# Altium project PCB_Project1.PrjPCB
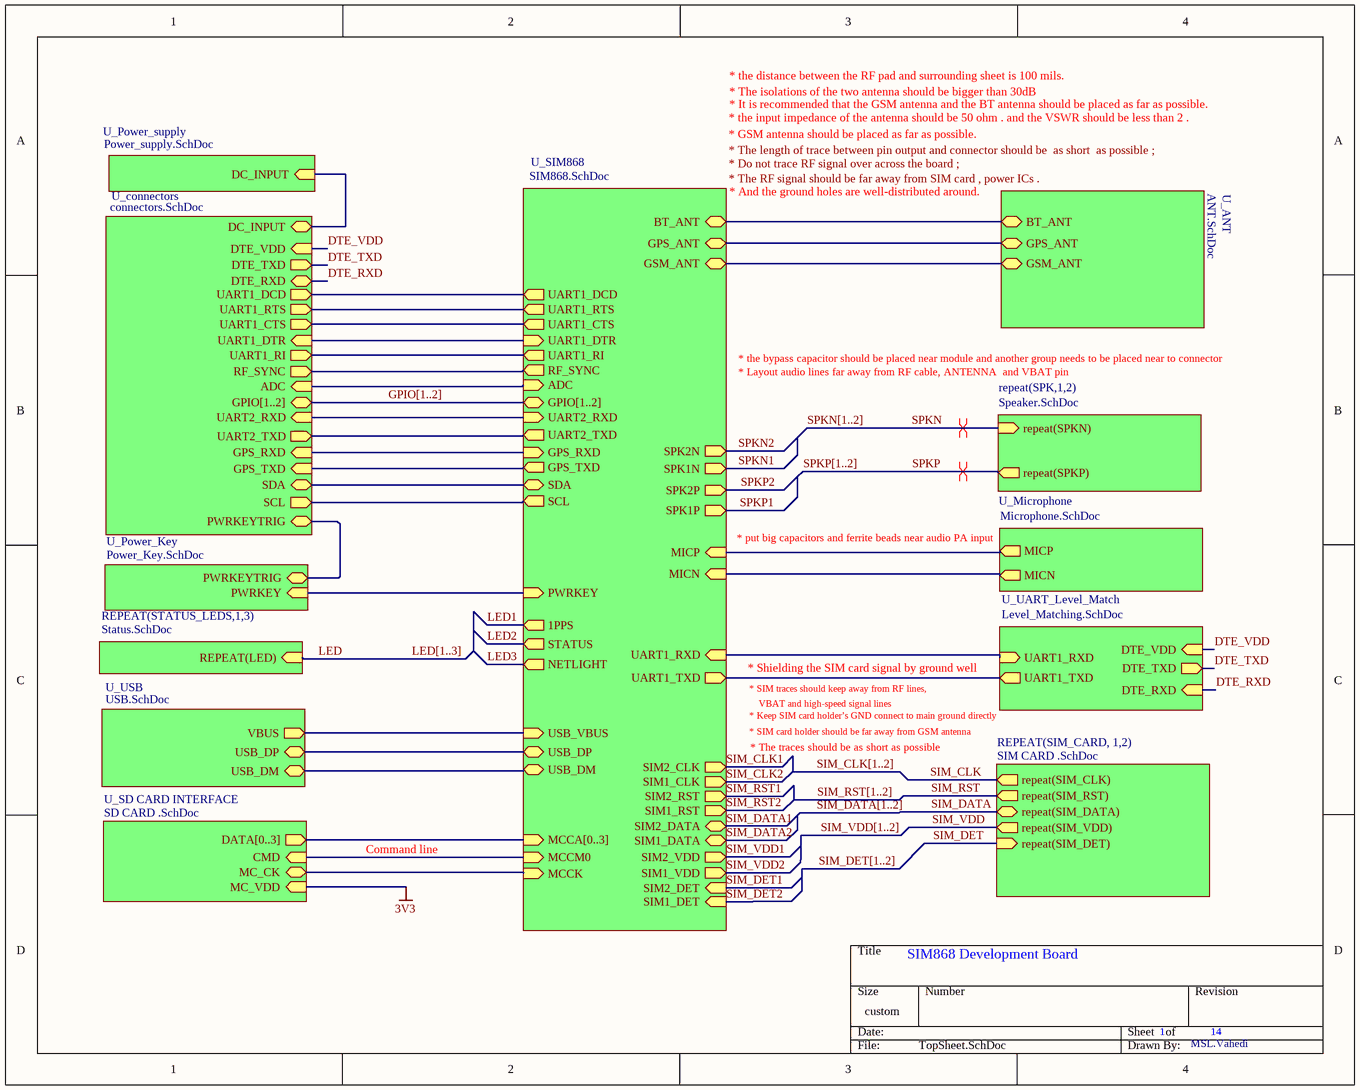
[diagram p0: TopSheet.SchDoc]
14 sheets, 152 parts. Net scope: hierarchical (ports join the sheet entries above them; power ports are global).
Board file: Sim_868_dev_board.PcbDoc
Sheets:
  TopSheet.SchDoc
    U_SIM868 = SIM868.SchDoc
    U_SD CARD INTERFACE = SD CARD .SchDoc
    U_USB = USB.SchDoc
    U_ANT = ANT.SchDoc
      AMC1 = Antenna matching circuit.SchDoc
      AMC2 = Antenna matching circuit.SchDoc
      AMC3 = Antenna matching circuit.SchDoc
    STATUS_LEDS1 = Status.SchDoc
    STATUS_LEDS2 = Status.SchDoc
    STATUS_LEDS3 = Status.SchDoc
    U_Power_Key = Power_Key.SchDoc
    U_UART_Level_Match = Level_Matching.SchDoc
    U_Microphone = Microphone.SchDoc
    SPK1 = Speaker.SchDoc
    SPK2 = Speaker.SchDoc
    U_connectors = connectors.SchDoc
    SIM_CARD1 = SIM CARD .SchDoc
    SIM_CARD2 = SIM CARD .SchDoc
    U_Power_supply = Power_supply.SchDoc

## Sheet TopSheet.SchDoc: SIM868 Development Board
size 254 x 203 mm; SheetNumber: 1; SheetTotal: 14

### Sub-sheets
REPEAT(SIM_CARD, 1,2) = SIM CARD .SchDoc: repeat(SIM_CLK) (out), repeat(SIM_RST) (out), repeat(SIM_DATA) (bidir), repeat(SIM_VDD) (out), repeat(SIM_DET) (in)
repeat(SPK,1,2) = Speaker.SchDoc: repeat(SPKP) (out), repeat(SPKN) (in)
REPEAT(STATUS_LEDS,1,3) = Status.SchDoc: REPEAT(LED) (in)
U_ANT = ANT.SchDoc: GSM_ANT (bidir), GPS_ANT (bidir), BT_ANT (bidir)
U_connectors = connectors.SchDoc: GPS_TXD (in), GPS_RXD (in), UART2_TXD (out), UART2_RXD (in), UART1_RTS (out), UART1_CTS (out), UART1_DCD (out), UART1_DTR (in), UART1_RI (out), GPIO[1..2] (bidir), PWRKEYTRIG (bidir), ADC (in), RF_SYNC (out), SDA (bidir), SCL (out), DTE_VDD (in), DTE_RXD (bidir), DTE_TXD (out), DC_INPUT (bidir)
U_Microphone = Microphone.SchDoc: MICP (out), MICN (out)
U_Power_Key = Power_Key.SchDoc: PWRKEY (in), PWRKEYTRIG (bidir)
U_Power_supply = Power_supply.SchDoc: DC_INPUT (in)
U_SD CARD INTERFACE = SD CARD .SchDoc: CMD (in), MC_CK (bidir), DATA[0..3] (out), MC_VDD (in)
U_SIM868 = SIM868.SchDoc: PWRKEY (in), SPK2N (out), SPK2P (out), SPK1N (out), SPK1P (out), MICN (in), MICP (in), MCCK (in), MCCM0 (in), 1PPS (out), MCCA[0..3] (in), NETLIGHT (out), STATUS (out), GPIO[1..2] (bidir), SIM2_DATA (bidir), SIM2_CLK (out), SIM2_RST (out), SIM2_VDD (out), GPS_TXD (out), GPS_RXD (in), UART1_TXD (out), UART1_RXD (in), UART2_TXD (out), UART2_RXD (in), USB_VBUS (in), USB_DP (bidir), USB_DM (bidir), ADC (in), SDA (bidir), SCL (out), SIM1_VDD (out), SIM1_DATA (bidir), SIM1_CLK (out), SIM1_RST (out), BT_ANT (bidir), GPS_ANT (bidir), GSM_ANT (bidir), RF_SYNC (out), UART1_RI (out), UART1_DTR (in), UART1_DCD (out), UART1_CTS (out), UART1_RTS (out), SIM1_DET (in), SIM2_DET (in)
U_UART_Level_Match = Level_Matching.SchDoc: DTE_VDD (in), DTE_RXD (in), UART1_TXD (out), DTE_TXD (out), UART1_RXD (in)
U_USB = USB.SchDoc: VBUS (out), USB_DM (bidir), USB_DP (bidir)

### Nets
ANTP1: sheet U_SIM868/GSM_ANT, sheet U_ANT/GSM_ANT
ANTP2: sheet U_SIM868/GPS_ANT, sheet U_ANT/GPS_ANT
DTE_RXD: sheet U_UART_Level_Match/DTE_RXD, sheet U_connectors/DTE_RXD
DTE_TXD: sheet U_UART_Level_Match/DTE_TXD, sheet U_connectors/DTE_TXD
DTE_VDD: sheet U_UART_Level_Match/DTE_VDD, sheet U_connectors/DTE_VDD
INPUT: sheet U_connectors/DC_INPUT, sheet U_Power_supply/DC_INPUT
LED: sheet REPEAT(STATUS_LEDS,1,3)/REPEAT(LED)
MIC_N: sheet U_SIM868/MICN, sheet U_Microphone/MICN
MIC_P: sheet U_SIM868/MICP, sheet U_Microphone/MICP
SIM_CLK: sheet REPEAT(SIM_CARD, 1,2)/repeat(SIM_CLK)
SIM_DATA: sheet REPEAT(SIM_CARD, 1,2)/repeat(SIM_DATA)
SIM_DET: sheet REPEAT(SIM_CARD, 1,2)/repeat(SIM_DET)
SIM_RST: sheet REPEAT(SIM_CARD, 1,2)/repeat(SIM_RST)
SIM_VDD: sheet REPEAT(SIM_CARD, 1,2)/repeat(SIM_VDD)
SPKN: sheet repeat(SPK,1,2)/repeat(SPKN)
SPKP: sheet repeat(SPK,1,2)/repeat(SPKP)
Net._2: sheet U_SIM868/PWRKEY, sheet U_Power_Key/PWRKEY
NetC9_2: sheet U_SIM868/USB_VBUS, sheet U_USB/VBUS
NetC108_2: sheet U_SIM868/BT_ANT, sheet U_ANT/BT_ANT
NetJ7_1: sheet U_Power_Key/PWRKEYTRIG, sheet U_connectors/PWRKEYTRIG
NetM1_1: sheet U_SIM868/UART1_TXD, sheet U_UART_Level_Match/UART1_TXD
NetM1_2: sheet U_SIM868/UART1_RXD, sheet U_UART_Level_Match/UART1_RXD
NetM1_3: sheet U_SIM868/UART1_RTS, sheet U_connectors/UART1_RTS
NetM1_4: sheet U_SIM868/UART1_CTS, sheet U_connectors/UART1_CTS
NetM1_5: sheet U_SIM868/UART1_DCD, sheet U_connectors/UART1_DCD
NetM1_6: sheet U_SIM868/UART1_DTR, sheet U_connectors/UART1_DTR
NetM1_7: sheet U_SIM868/UART1_RI, sheet U_connectors/UART1_RI
NetM1_22: sheet U_SIM868/UART2_TXD, sheet U_connectors/UART2_TXD
NetM1_23: sheet U_SIM868/UART2_RXD, sheet U_connectors/UART2_RXD
NetM1_25: sheet U_SIM868/USB_DP, sheet U_USB/USB_DP
NetM1_26: sheet U_SIM868/USB_DM, sheet U_USB/USB_DM
NetM1_29: sheet U_SIM868/RF_SYNC, sheet U_connectors/RF_SYNC
NetM1_38: sheet U_SIM868/ADC, sheet U_connectors/ADC
NetM1_50: sheet U_SIM868/MCCK, sheet U_SD CARD INTERFACE/MC_CK
NetM1_51: sheet U_SIM868/MCCM0, sheet U_SD CARD INTERFACE/CMD
NetM1_61: sheet U_SIM868/GPS_TXD, sheet U_connectors/GPS_TXD
NetM1_62: sheet U_SIM868/GPS_RXD, sheet U_connectors/GPS_RXD
NetM1_64: sheet U_SIM868/SDA, sheet U_connectors/SDA
NetM1_65: sheet U_SIM868/SCL, sheet U_connectors/SCL

### Buses and harness runs
bus GPIO[1..2] = sheet U_connectors/GPIO[1..2] = sheet U_SIM868/GPIO[1..2]
bus LED[1..3]
bus sheet U_SD CARD INTERFACE/DATA[0..3] = sheet U_SIM868/MCCA[0..3]
bus SIM_CLK[1..2]
bus SIM_DATA[1..2]
bus SIM_DET[1..2]
bus SIM_RST[1..2]
bus SIM_VDD[1..2]
bus SPKN[1..2]
bus SPKP[1..2]

### Layout directives
differential pair: SPKN, SPKP

### Notes on the sheet
- * The isolations of the two antenna should be bigger than 30dB
- * the distance between the RF pad and surrounding sheet is 100 mils.
- * the input impedance of the antenna should be 50 ohm . and the VSWR should be less than 2 .
- * GSM antenna should be placed as far as possible.
- * The length of trace between pin output and connector should be  as short  as possible ;
- * Do not trace RF signal over across the board ;
- * It is recommended that the GSM antenna and the BT antenna should be placed as far as possible.
- * The RF signal should be far away from SIM card , power ICs .
- * And the ground holes are well-distributed around.
- * the bypass capacitor should be placed near module and another group needs to be placed near to connector
- * Layout audio lines far away from RF cable, ANTENNA  and VBAT pin
- * put big capacitors and ferrite beads near audio PA input
- * Shielding the SIM card signal by ground well
- * SIM traces should keep away from RF lines,
- VBAT and high-speed signal lines
- * SIM card holder should be far away from GSM antenna
- * Keep SIM card holder’s GND connect to main ground directly
- * The traces should be as short as possible
- Command line
- MSL.Vahedi
- Title
- Size:
- Date:
- A
- Number:
- Time:
- Revision:
- Sheet
- of
- File:

## Sheet SIM868.SchDoc: Sim868 Development Board
size A; SheetNumber: 2; SheetTotal: 14
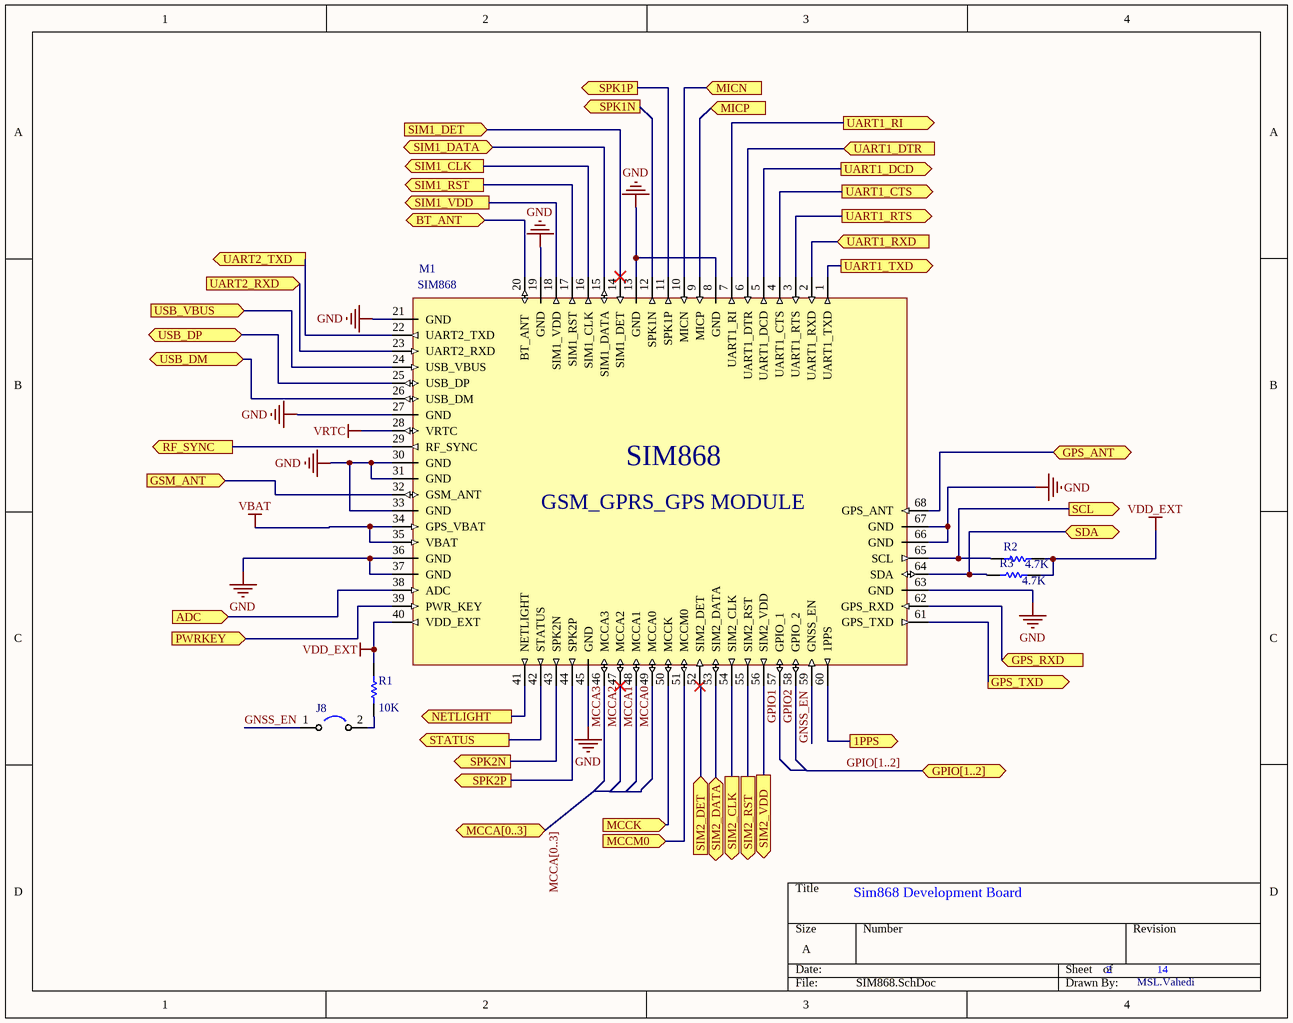
[diagram p1: SIM868.SchDoc]

### Parts
J8  (no value)  [JuMPER]
M1  SIM868  [SIM868]
R1  value 10K  [RES0805]
R2  value 4.7K  [RES0805]
R3  value 4.7K  [RES0805]

### Ports
1PPS (out), ADC (in), BT_ANT (bidir), GPIO[1..2] (bidir), GPS_ANT (bidir), GPS_RXD (in), GPS_TXD (out), GSM_ANT (in), MCCA[0..3] (bidir), MCCK (in), MCCM0 (in), MICN (in), MICP (in), NETLIGHT (out), PWRKEY (in), RF_SYNC (out), SCL (out), SDA (bidir), SIM1_CLK (out), SIM1_DATA (bidir), SIM1_DET (in), SIM1_RST (out), SIM1_VDD (out), SIM2_CLK (out), SIM2_DATA (bidir), SIM2_DET (in), SIM2_RST (out), SIM2_VDD (out), SPK1N (out), SPK1P (out), SPK2N (out), SPK2P (out), STATUS (out), UART1_CTS (out), UART1_DCD (out), UART1_DTR (in), UART1_RI (out), UART1_RTS (out), UART1_RXD (in), UART1_TXD (out), UART2_RXD (in), UART2_TXD (out), USB_DM (bidir), USB_DP (bidir), USB_VBUS (in)

### Nets
GND: M1.8(GND) M1.13(GND) M1.19(GND) M1.21(GND) M1.27(GND) M1.30(GND) M1.31(GND) M1.33(GND) M1.36(GND) M1.37(GND) M1.45(GND) M1.63(GND) M1.66(GND) M1.67(GND)
VBAT: M1.34(GPS_VBAT) M1.35(VBAT)
VDD_EXT: M1.40(VDD_EXT) R1.2 R2.2 R3.2
VRTC: M1.28(VRTC)
ANTP1: M1.32(GSM_ANT) ; port GSM_ANT
ANTP2: M1.68(GPS_ANT) ; port GPS_ANT
DIFF_SPK_N: M1.12(SPK1N) ; port SPK1N
DIFF_SPK_N: M1.43(SPK2N) ; port SPK2N  [a separate net that carries the same name]
DIFF_SPK_P: M1.11(SPK1P) ; port SPK1P
DIFF_SPK_P: M1.44(SPK2P) ; port SPK2P  [a separate net that carries the same name]
GNSS_EN: J8.1 M1.59(GNSS_EN)
GPIO1: M1.57(GPIO_1)
GPIO2: M1.58(GPIO_2)
LED1: M1.60(1PPS) ; port 1PPS
LED2: M1.42(STATUS) ; port STATUS
LED3: M1.41(NETLIGHT) ; port NETLIGHT
MCCA0: M1.49(MCCA0)  [project net DATA0]
MCCA1: M1.48(MCCA1)  [project net DATA1]
MCCA2: M1.47(MCCA2)  [project net DATA2]
MCCA3: M1.46(MCCA3)  [project net DATA3]
MIC_N: M1.10(MICN) ; port MICN
MIC_P: M1.9(MICP) ; port MICP
SIM_CLK1: M1.54(SIM2_CLK) ; port SIM2_CLK
SIM_CLK2: M1.16(SIM1_CLK) ; port SIM1_CLK
SIM_DATA1: M1.53(SIM2_DATA) ; port SIM2_DATA
SIM_DATA2: M1.15(SIM1_DATA) ; port SIM1_DATA
SIM_DET: M1.14(SIM1_DET) ; port SIM1_DET
SIM_DET: M1.52(SIM2_DET) ; port SIM2_DET  [a separate net that carries the same name]
SIM_RST1: M1.55(SIM2_RST) ; port SIM2_RST
SIM_RST2: M1.17(SIM1_RST) ; port SIM1_RST
SIM_VDD: M1.18(SIM1_VDD) ; port SIM1_VDD
SIM_VDD: M1.56(SIM2_VDD) ; port SIM2_VDD  [a separate net that carries the same name]
Net._2: M1.39(PWR_KEY) ; port PWRKEY
NetC9_2: M1.24(USB_VBUS) ; port USB_VBUS
NetC108_2: M1.20(BT_ANT) ; port BT_ANT
NetJ8_2: J8.2 R1.1
NetM1_1: M1.1(UART1_TXD) ; port UART1_TXD
NetM1_2: M1.2(UART1_RXD) ; port UART1_RXD
NetM1_3: M1.3(UART1_RTS) ; port UART1_RTS
NetM1_4: M1.4(UART1_CTS) ; port UART1_CTS
NetM1_5: M1.5(UART1_DCD) ; port UART1_DCD
NetM1_6: M1.6(UART1_DTR) ; port UART1_DTR
NetM1_7: M1.7(UART1_RI) ; port UART1_RI
NetM1_22: M1.22(UART2_TXD) ; port UART2_TXD
NetM1_23: M1.23(UART2_RXD) ; port UART2_RXD
NetM1_25: M1.25(USB_DP) ; port USB_DP
NetM1_26: M1.26(USB_DM) ; port USB_DM
NetM1_29: M1.29(RF_SYNC) ; port RF_SYNC
NetM1_38: M1.38(ADC) ; port ADC
NetM1_50: M1.50(MCCK) ; port MCCK
NetM1_51: M1.51(MCCM0) ; port MCCM0
NetM1_61: M1.61(GPS_TXD) ; port GPS_TXD
NetM1_62: M1.62(GPS_RXD) ; port GPS_RXD
NetM1_64: M1.64(SDA) R3.1 ; port SDA
NetM1_65: M1.65(SCL) R2.1 ; port SCL

### Buses and harness runs
bus GPIO[1..2] = port GPIO[1..2]
bus MCCA[0..3] = port MCCA[0..3]

### Notes on the sheet
- MSL.Vahedi
- (in symbol SIM868) GSM_GPRS_GPS MODULE

### Library data of the parts
J8 = JUMPER
R1-R3 = Res1: Resistor; Published: 8-Jun-2000; LatestRevisionDate: 17-Jul-2002; LatestRevisionNote: Re-released for DXP Platform.; PackageReference: AXIAL-0.3; Publisher: Altium Limited; PackageDescription: Axial Device, Thru-Hole; 2 Leads; 0.3 in Pin Spacing

## Sheet SD CARD .SchDoc: SIM868 Development Board
size 149 x 200 mm; SheetNumber: 10; SheetTotal: 14
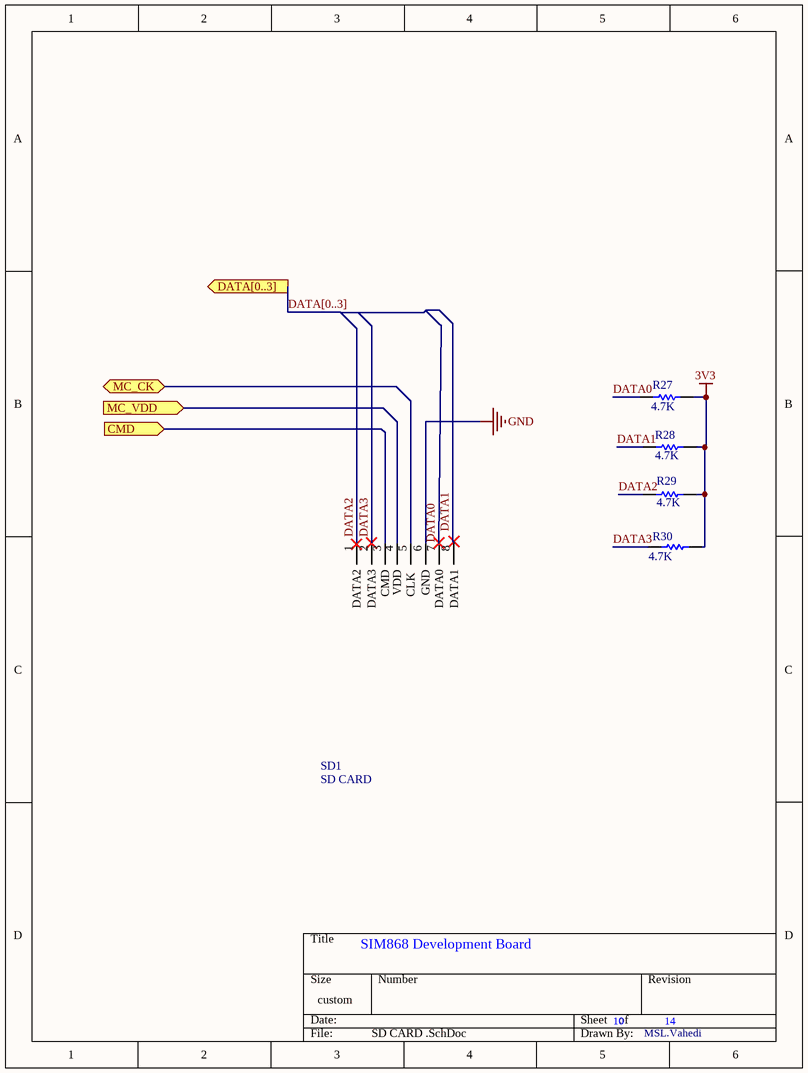
[diagram p2: SD CARD .SchDoc]

### Parts
R27  value 4.7K  [RES0805]
R28  value 4.7K  [RES0805]
R29  value 4.7K  [RES0805]
R30  value 4.7K  [RES0805]
SD1  SD CARD  [SD_CARD]

### Ports
CMD (in), DATA[0..3] (out), MC_CK (bidir), MC_VDD (in)

### Nets
3V3: R27.2 R28.2 R29.2 R30.2 SD1.4(VDD) ; port MC_VDD
GND: SD1.6(GND)
DATA0: R27.1 SD1.7(DATA0)
DATA1: R28.1 SD1.8(DATA1)
DATA2: R29.1 SD1.1(DATA2)
DATA3: R30.1 SD1.2(DATA3)
NetM1_50: SD1.5(CLK) ; port MC_CK
NetM1_51: SD1.3(CMD) ; port CMD

### Buses and harness runs
bus DATA[0..3] = port DATA[0..3]

### Notes on the sheet
- MSL.Vahedi

### Library data of the parts
R27-R30 = Res1: Resistor; Published: 8-Jun-2000; LatestRevisionDate: 17-Jul-2002; LatestRevisionNote: Re-released for DXP Platform.; PackageReference: AXIAL-0.3; Publisher: Altium Limited; PackageDescription: Axial Device, Thru-Hole; 2 Leads; 0.3 in Pin Spacing

## Sheet USB.SchDoc: SIM868 Development Board
size 149 x 149 mm; SheetNumber: 3; SheetTotal: 14
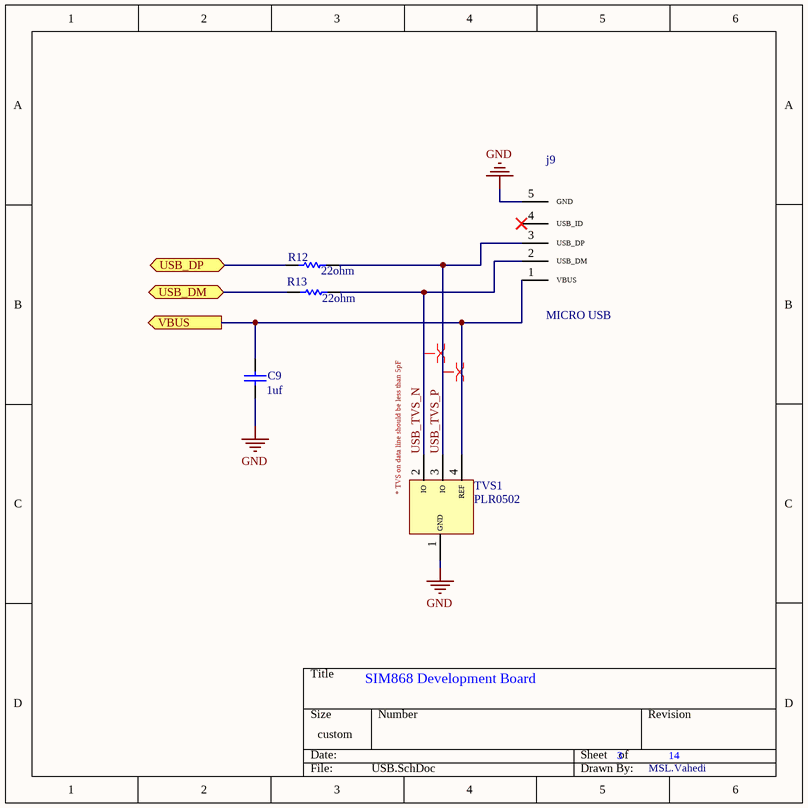
[diagram p3: USB.SchDoc]

### Parts
C9  value 1uf  [CAP0805]
j9  MICRO USB  [Micro_USB]
R12  value 22ohm  [RES0805]
R13  value 22ohm  [RES0805]
TVS1  PLR0502  [PLR0502]

### Ports
USB_DM (bidir), USB_DP (bidir), VBUS (out)

### Nets
GND: C9.1 j9.5(GND) TVS1.1(GND)
USB_TVS_N: j9.2(USB_DM) R13.2 TVS1.2(IO)
USB_TVS_P: j9.3(USB_DP) R12.2 TVS1.3(IO)
NetC9_2: C9.2 j9.1(VBUS) TVS1.4(REF) ; port VBUS
NetM1_25: R12.1 ; port USB_DP
NetM1_26: R13.1 ; port USB_DM

Not connected (* = marked no-connect by the designer): j9 4(USB_ID)*

### Layout directives
differential pair; differential pair class USBDIFF: USB_TVS_N, USB_TVS_P

### Notes on the sheet
- (near TVS1) * TVS on data line should be less than 5pF
- MSL.Vahedi

### Library data of the parts
C9 = Cap: Capacitor; Published: 8-Jun-2000; LatestRevisionDate: 17-Jul-2002; LatestRevisionNote: Re-released for DXP Platform.; PackageReference: RAD-0.3; Publisher: Altium Limited; PackageDescription: Radial Cap, Thru-Hole; 2 Leads; 0.3 in Pin Spacing
R12 R13 = Res1: Published: 8-Jun-2000; LatestRevisionDate: 17-Jul-2002; LatestRevisionNote: Re-released for DXP Platform.; PackageReference: AXIAL-0.3; Publisher: Altium Limited; PackageDescription: Axial Device, Thru-Hole; 2 Leads; 0.3 in Pin Spacing

## Sheet ANT.SchDoc: SIM868 Development Board
size A4; SheetNumber: 4; SheetTotal: 14
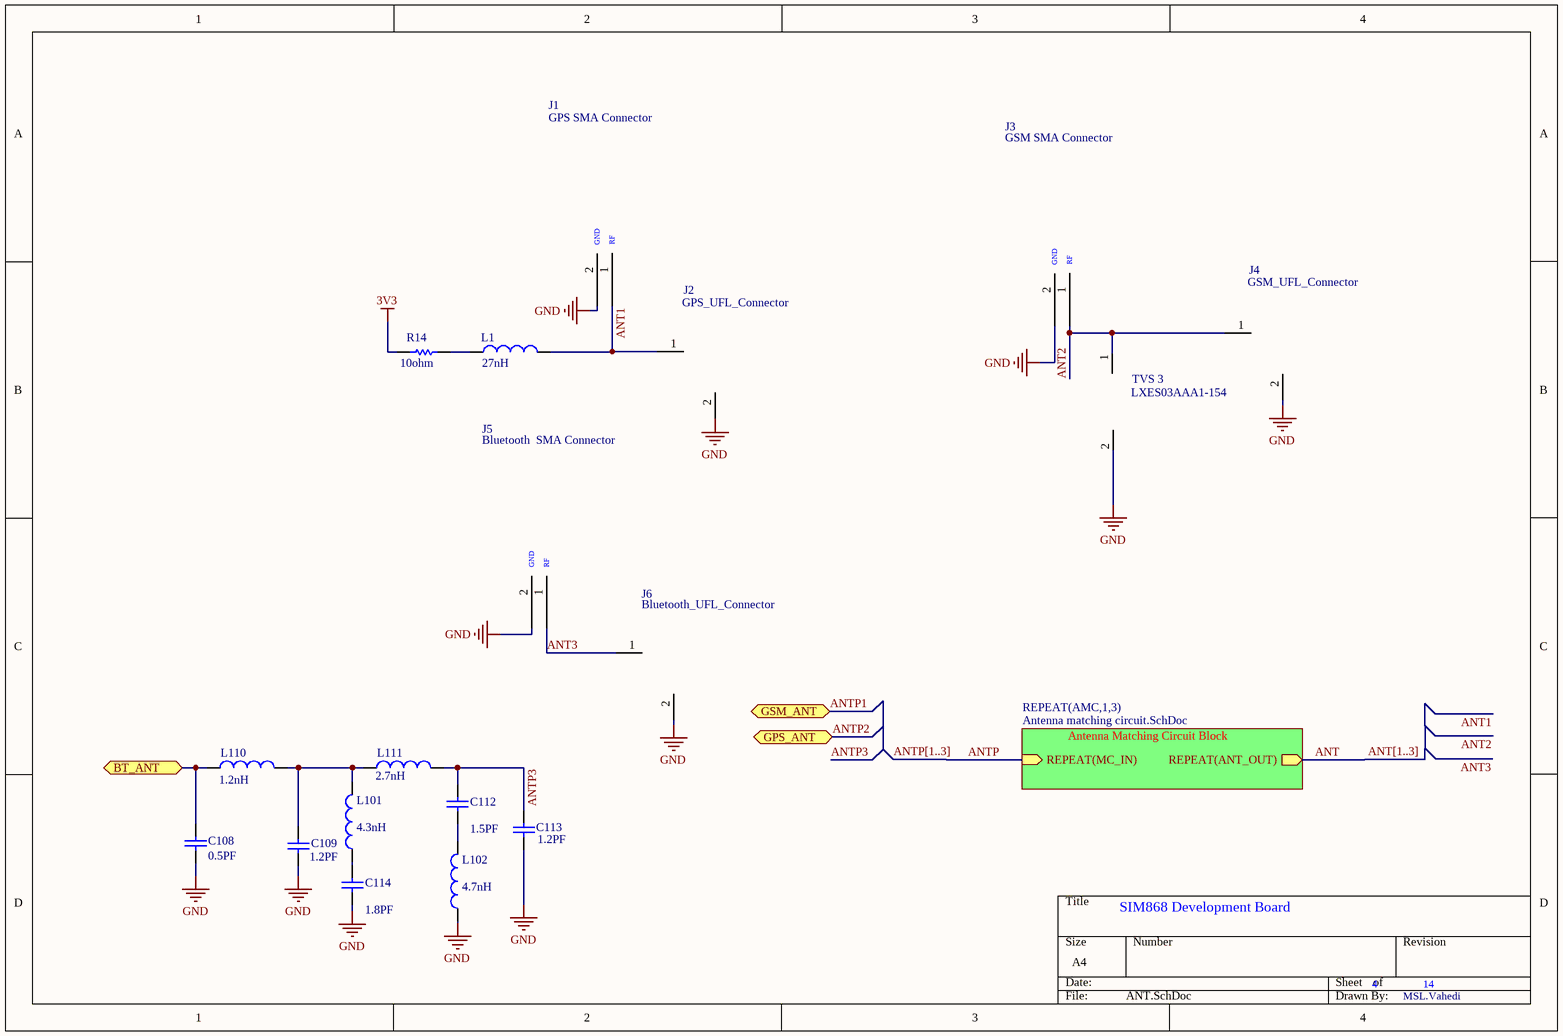
[diagram p4: ANT.SchDoc]

### Parts
C108  value 0.5PF  [RAD-0.3]
C109  value 1.2PF  [RAD-0.3]
C112  value 1.5PF  [RAD-0.3]
C113  value 1.2PF  [RAD-0.3]
C114  value 1.8PF  [RAD-0.3]
J1  GPS SMA Connector  [SMA right Angle]
J2  GPS_UFL_Connector  [UFL_Connector]
J3  GSM SMA Connector  [SMA right Angle]
J4  GSM_UFL_Connector  [UFL_Connector]
J5  Bluetooth  SMA Connector  [SMA right Angle]
J6  Bluetooth_UFL_Connector  [UFL_Connector]
L1  value 27nH  [INDC1608L]
L101  value 4.3nH  [0402-A]
L102  value 4.7nH  [0402-A]
L110  value 1.2nH  [0402-A]
L111  value 2.7nH  [0402-A]
R14  value 10ohm  [RES0805]
TVS_3  LXES03AAA1-154  [*FB_BLM18PG121SN1D]

### Sub-sheets
REPEAT(AMC,1,3) = Antenna matching circuit.SchDoc: REPEAT(ANT_OUT) (out), REPEAT(MC_IN) (in)

### Ports
BT_ANT (bidir), GPS_ANT (bidir), GSM_ANT (bidir)

### Nets
3V3: R14.1
GND: C108.1 C109.1 C113.1 C114.1 J1.2(GND) J2.2 J3.2(GND) J4.2 J5.2(GND) J6.2 L102.1 TVS_3.2
ANT: sheet REPEAT(AMC,1,3)/REPEAT(ANT_OUT)
ANT1: J1.1(RF) J2.1 L1.2
ANT2: J3.1(RF) J4.1 TVS_3.1
ANT3: J5.1(RF) J6.1
ANTP: sheet REPEAT(AMC,1,3)/REPEAT(MC_IN)
ANTP3: C112.2 C113.2 L111.2
NetC108_2: C108.2 L110.1 ; port BT_ANT
NetC109_2: C109.2 L101.2 L110.2 L111.1
NetC112_1: C112.1 L102.2
NetC114_2: C114.2 L101.1
NetL1_1: L1.1 R14.2

### Buses and harness runs
bus ANT[1..3]
bus ANTP[1..3]

### Notes on the sheet
- Antenna Matching Circuit Block
- MSL.Vahedi

### Library data of the parts
C108 C109 C112-C114 = Cap: Capacitor; Published: 8-Jun-2000; LatestRevisionDate: 17-Jul-2002; LatestRevisionNote: Re-released for DXP Platform.; PackageReference: RAD-0.3; Publisher: Altium Limited; PackageDescription: Radial Cap, Thru-Hole; 2 Leads; 0.3 in Pin Spacing
J1 J3 J5 = SMA Connector
J2 J4 J6 = UFL
L1 L101 L102 L110 L111 = Inductor: Code_IEC: 1005; Published: 8-Jun-2000; LatestRevisionDate: 29-May-2009; LatestRevisionNote: IPC-7351 Footprint Added.; PackageReference: 0402-A; Publisher: Altium Limited; PackageDescription: Chip Inductor; Code_JEITA: 0402
R14 = Res1: Resistor; Published: 8-Jun-2000; LatestRevisionDate: 17-Jul-2002; LatestRevisionNote: Re-released for DXP Platform.; PackageReference: AXIAL-0.3; Publisher: Altium Limited; PackageDescription: Axial Device, Thru-Hole; 2 Leads; 0.3 in Pin Spacing
TVS_3 = TVS: Recommended vendor  MURATA LXE03AAA1-154 || MURATA LXES015AAA1-154

## Sheet Antenna matching circuit.SchDoc: SIM868 Development Board
size 100 x 119 mm; SheetNumber: 5; SheetTotal: 14
Used 3 times, as channels U_ANT/AMC1, U_ANT/AMC2, U_ANT/AMC3. Parts and nets are listed once, with the designators drawn on the sheet.
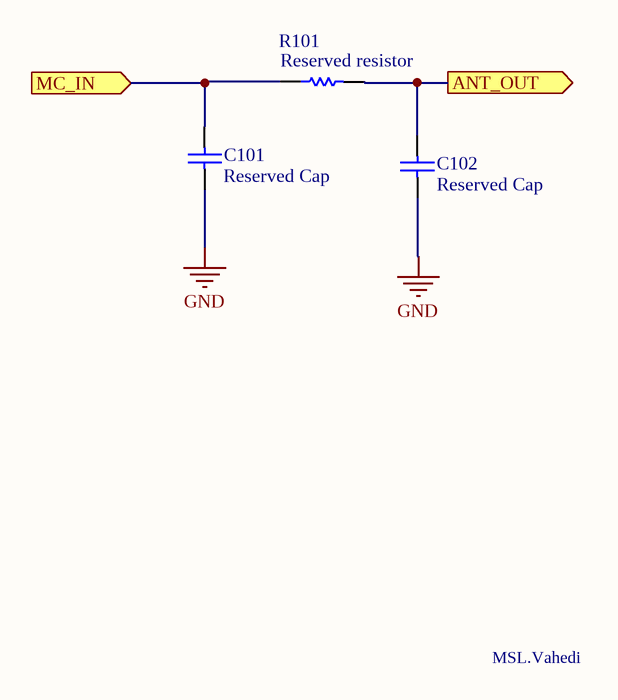
[diagram p5: Antenna matching circuit.SchDoc]

### Parts
C101  Reserved Cap  [CAP0805]
C102  Reserved Cap  [CAP0805]
R101  Reserved resistor  [RES0805]

### Ports
ANT_OUT (out), MC_IN (in)

### Nets
GND: C101.1 C102.1
ANT_OUT: C102.2 R101.2 ; port ANT_OUT
MC_IN: C101.2 R101.1 ; port MC_IN

### Channels
U_ANT/AMC1: designators end in _AMC1; ports ANT_OUT=ANT1 MC_IN=ANTP1
U_ANT/AMC2: designators end in _AMC2; ports ANT_OUT=ANT2 MC_IN=ANTP2
U_ANT/AMC3: designators end in _AMC3; ports ANT_OUT=ANT3 MC_IN=ANTP3

### Notes on the sheet
- MSL.Vahedi

### Library data of the parts
C101 C102 = Cap: Capacitor; Published: 8-Jun-2000; LatestRevisionDate: 17-Jul-2002; LatestRevisionNote: Re-released for DXP Platform.; PackageReference: RAD-0.3; Publisher: Altium Limited; PackageDescription: Radial Cap, Thru-Hole; 2 Leads; 0.3 in Pin Spacing
R101 = Res1: Resistor; Published: 8-Jun-2000; LatestRevisionDate: 17-Jul-2002; LatestRevisionNote: Re-released for DXP Platform.; PackageReference: AXIAL-0.3; Publisher: Altium Limited; PackageDescription: Axial Device, Thru-Hole; 2 Leads; 0.3 in Pin Spacing

## Sheet Status.SchDoc: SIM868 Development Board
size 149 x 149 mm; SheetNumber: 6; SheetTotal: 14
Used 3 times, as channels STATUS_LEDS1, STATUS_LEDS2, STATUS_LEDS3. Parts and nets are listed once, with the designators drawn on the sheet.
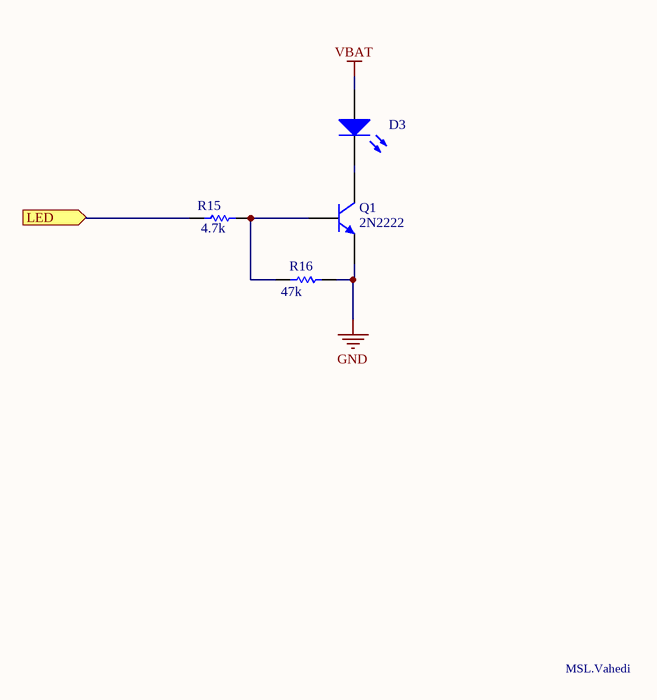
[diagram p6: Status.SchDoc]

### Parts
D3  (no value)  [LED_0805_BLUE]
Q1  2N2222  [SOT-23]
R15  value 4.7k  [RES0805]
R16  value 47k  [RES0805]

### Ports
LED (in)

### Nets
GND: Q1.1(E) R16.2
VBAT: D3.1(A)
LED: R15.1 ; port LED
NetD3_2: D3.2(K) Q1.3(C)
NetQ1_2: Q1.2(B) R15.2 R16.1

### Channels
STATUS_LEDS1: designators end in _STATUS_LEDS1; ports LED=LED1
STATUS_LEDS2: designators end in _STATUS_LEDS2; ports LED=LED2
STATUS_LEDS3: designators end in _STATUS_LEDS3; ports LED=LED3

### Notes on the sheet
- MSL.Vahedi

### Library data of the parts
D3 = LED0: Typical INFRARED GaAs LED; Published: 8-Jun-2000; LatestRevisionDate: 08-Jul-2005; LatestRevisionNote: Mech Layer 1 removed.; PackageReference: LED-0; Publisher: Altium Limited; PackageDescription: LED; 2 Leads
Q1 = 2N3904: NPN General Purpose Amplifier; Published: 8-Jun-2000; LatestRevisionDate: 15-Jan-2003; LatestRevisionNote: PCB Footprint 'BCY-W3/D4.7' replaced; DatasheetVersion: 1997; PackageVersion: Sep-1998; PackageReference: TO-92A; Publisher: Altium Limited; PackageDescription: TO, Flat Index; 3 In-Line, Axial Leads; Body Dia. 4.5mm; Leads 0.51 x 0.48 mm (max); ComponentLink1Description: Manufacturer Link; ComponentLink1URL: http://www.fairchildsemi.com/; ComponentLink2Description: Datasheet; ComponentLink2URL: http://www.fairchildsemi.com/ds/2N%2F2N3904.pdf
R15 R16 = Res1: Resistor; Published: 8-Jun-2000; LatestRevisionDate: 17-Jul-2002; LatestRevisionNote: Re-released for DXP Platform.; PackageReference: AXIAL-0.3; Publisher: Altium Limited; PackageDescription: Axial Device, Thru-Hole; 2 Leads; 0.3 in Pin Spacing

## Sheet Power_Key.SchDoc: SIM868 Development Board
size 149 x 149 mm; SheetNumber: 7; SheetTotal: 14
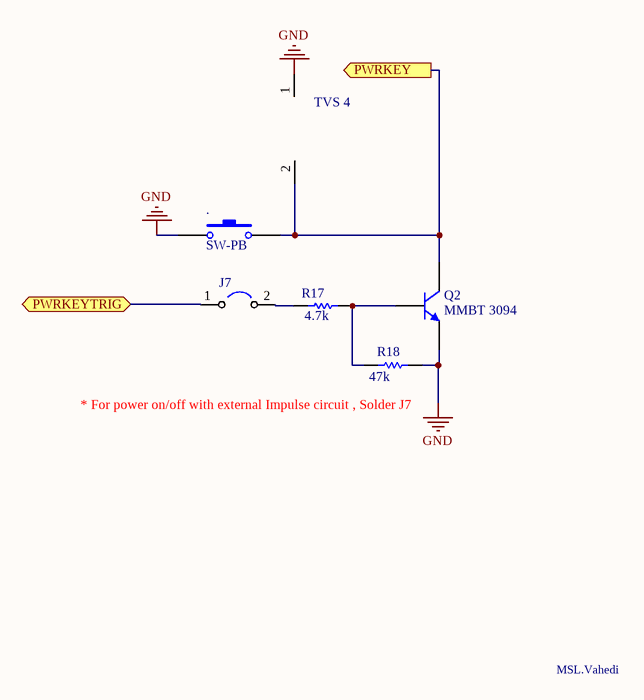
[diagram p7: Power_Key.SchDoc]

### Parts
.  SW-PB  [BUTTON_MICRO_SWITCH]
J7  (no value)  [JuMPER]
Q2  MMBT 3094  [SOT-23]
R17  value 4.7k  [RES0805]
R18  value 47k  [RES0805]
TVS_4  (no value)  [*FB_BLM18PG121SN1D]

### Ports
PWRKEY (out), PWRKEYTRIG (bidir)

### Nets
GND: ..1 Q2.1(E) R18.2 TVS_4.1
Net._2: ..2 Q2.3(C) TVS_4.2 ; port PWRKEY
NetJ7_1: J7.1 ; port PWRKEYTRIG
NetJ7_2: J7.2 R17.1
NetQ2_2: Q2.2(B) R17.2 R18.1

### Notes on the sheet
- (near R18) * For power on/off with external Impulse circuit , Solder J7
- MSL.Vahedi

### Library data of the parts
. = SW-PB: Switch; Published: 24-Mar-1999; LatestRevisionDate: 17-Jul-2002; LatestRevisionNote: Re-released for DXP Platform.; PackageReference: SPST-2; Publisher: Altium Limited; PackageDescription: Switch; 2 Leads
J7 = JUMPER
Q2 = 2N3904: NPN General Purpose Amplifier; Published: 8-Jun-2000; LatestRevisionDate: 15-Jan-2003; LatestRevisionNote: PCB Footprint 'BCY-W3/D4.7' replaced; DatasheetVersion: 1997; PackageVersion: Sep-1998; PackageReference: TO-92A; Publisher: Altium Limited; PackageDescription: TO, Flat Index; 3 In-Line, Axial Leads; Body Dia. 4.5mm; Leads 0.51 x 0.48 mm (max); ComponentLink1Description: Manufacturer Link; ComponentLink1URL: http://www.fairchildsemi.com/; ComponentLink2Description: Datasheet; ComponentLink2URL: http://www.fairchildsemi.com/ds/2N%2F2N3904.pdf
R17 R18 = Res1: Resistor; Published: 8-Jun-2000; LatestRevisionDate: 17-Jul-2002; LatestRevisionNote: Re-released for DXP Platform.; PackageReference: AXIAL-0.3; Publisher: Altium Limited; PackageDescription: Axial Device, Thru-Hole; 2 Leads; 0.3 in Pin Spacing
TVS_4 = TVS

## Sheet Level_Matching.SchDoc: SIM868 Development Board
size 119 x 149 mm; SheetNumber: 13; SheetTotal: 14
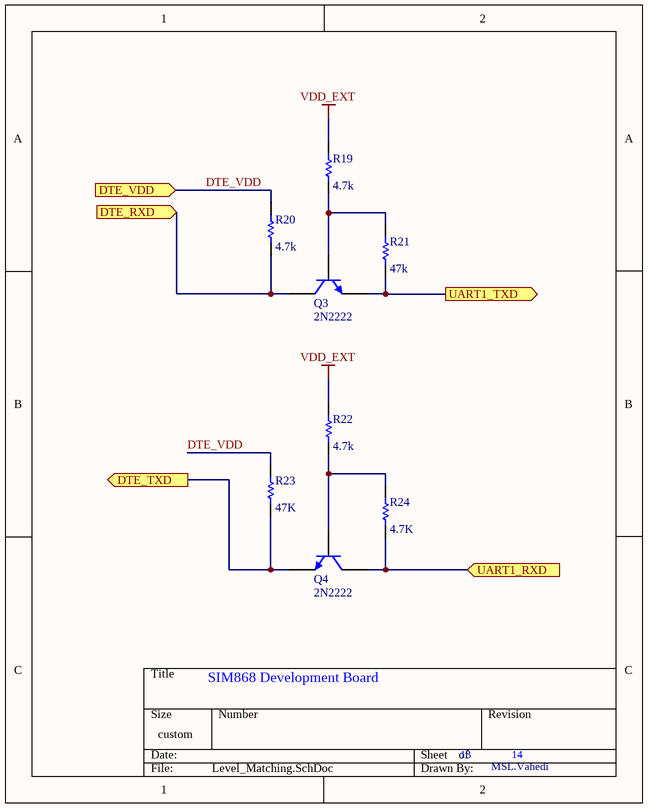
[diagram p8: Level_Matching.SchDoc]

### Parts
Q3  2N2222  [SOT-23]
Q4  2N2222  [SOT-23]
R19  value 4.7k  [RES0805]
R20  value 4.7k  [RES0805]
R21  value 47k  [RES0805]
R22  value 4.7k  [RES0805]
R23  value 47K  [RES0805]
R24  value 4.7K  [RES0805]

### Ports
DTE_RXD (in), DTE_TXD (out), DTE_VDD (in), UART1_RXD (in), UART1_TXD (out)

### Nets
VDD_EXT: R19.1 R22.1
DTE_RXD: Q3.3(C) R20.2 ; port DTE_RXD
DTE_TXD: Q4.1(E) R23.2 ; port DTE_TXD
DTE_VDD: R20.1 R23.1 ; port DTE_VDD
NetM1_1: Q3.1(E) R21.2 ; port UART1_TXD
NetM1_2: Q4.3(C) R24.2 ; port UART1_RXD
NetQ3_2: Q3.2(B) R19.2 R21.1
NetQ4_2: Q4.2(B) R22.2 R24.1

### Notes on the sheet
- MSL.Vahedi

### Library data of the parts
Q3 Q4 = 2N3904: NPN General Purpose Amplifier; Published: 8-Jun-2000; LatestRevisionDate: 15-Jan-2003; LatestRevisionNote: PCB Footprint 'BCY-W3/D4.7' replaced; DatasheetVersion: 1997; PackageVersion: Sep-1998; PackageReference: TO-92A; Publisher: Altium Limited; PackageDescription: TO, Flat Index; 3 In-Line, Axial Leads; Body Dia. 4.5mm; Leads 0.51 x 0.48 mm (max); ComponentLink1Description: Manufacturer Link; ComponentLink1URL: http://www.fairchildsemi.com/; ComponentLink2Description: Datasheet; ComponentLink2URL: http://www.fairchildsemi.com/ds/2N%2F2N3904.pdf
R19-R24 = Res1: Resistor; Published: 8-Jun-2000; LatestRevisionDate: 17-Jul-2002; LatestRevisionNote: Re-released for DXP Platform.; PackageReference: AXIAL-0.3; Publisher: Altium Limited; PackageDescription: Axial Device, Thru-Hole; 2 Leads; 0.3 in Pin Spacing

## Sheet Microphone.SchDoc: SIM868 Development Board
size 199 x 149 mm; SheetNumber: 8; SheetTotal: 14
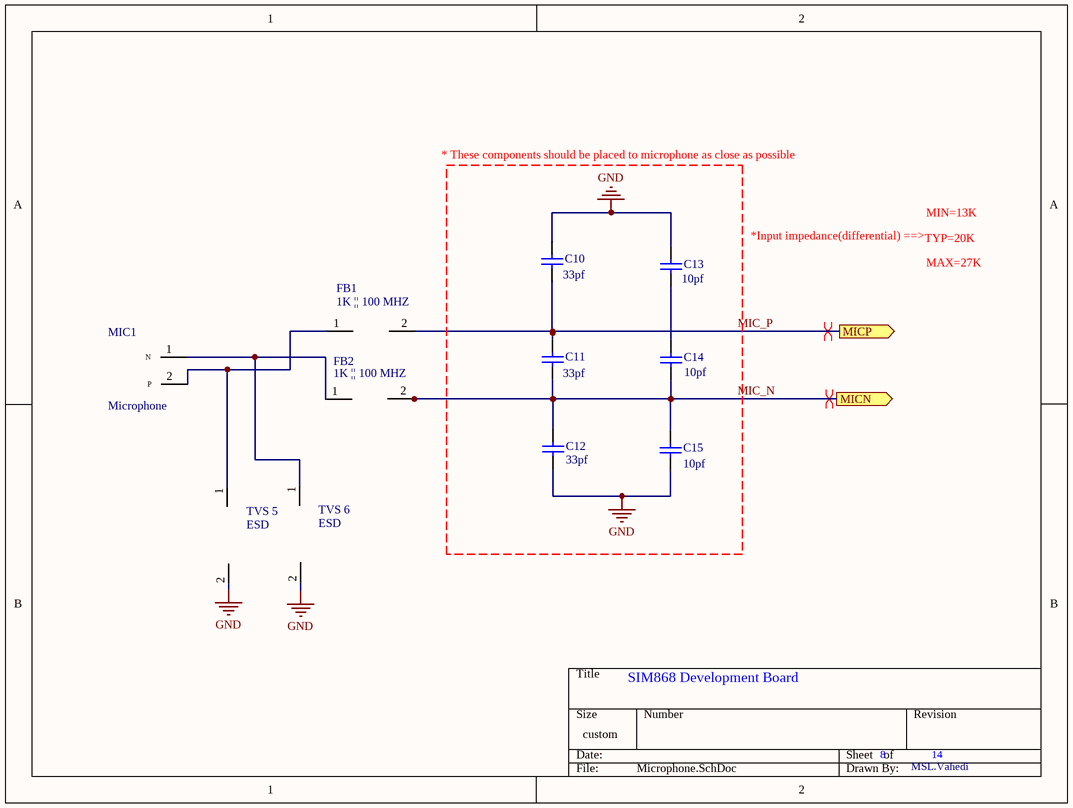
[diagram p9: Microphone.SchDoc]

### Parts
C10  value 33pf  [CAP0805]
C11  value 33pf  [CAP0805]
C12  value 33pf  [CAP0805]
C13  value 10pf  [CAP0805]
C14  value 10pf  [CAP0805]
C15  value 10pf  [CAP0805]
FB1  1K || 100 MHZ  [RES0805]
FB2  1K || 100 MHZ  [RES0805]
MIC1  Microphone  [MIC]
TVS_5  ESD  [*FB_BLM18PG121SN1D]
TVS_6  ESD  [*FB_BLM18PG121SN1D]

### Ports
MICN (out), MICP (out)

### Nets
GND: C10.1 C12.2 C13.1 C15.2 TVS_5.2 TVS_6.2
MIC_N: C11.2 C12.1 C14.2 C15.1 FB2.2 ; port MICN
MIC_P: C10.2 C11.1 FB1.2 ; port MICP
NetC13_2: C13.2 C14.1
NetFB1_1: FB1.1 MIC1.2(P) TVS_5.1
NetFB2_1: FB2.1 MIC1.1(N) TVS_6.1

### Layout directives
differential pair; differential pair class MICDIFF: MIC_N, MIC_P

### Notes on the sheet
- * These components should be placed to microphone as close as possible
- MIN=13K
- *Input impedance(differential) ==>
- TYP=20K
- MAX=27K
- MSL.Vahedi

### Library data of the parts
C10-C15 = Cap: Capacitor; Published: 8-Jun-2000; LatestRevisionDate: 17-Jul-2002; LatestRevisionNote: Re-released for DXP Platform.; PackageReference: RAD-0.3; Publisher: Altium Limited; PackageDescription: Radial Cap, Thru-Hole; 2 Leads; 0.3 in Pin Spacing
FB1 FB2 = Ferrite bead
TVS_5 TVS_6 = TVS

## Sheet Speaker.SchDoc: SIM868 Development Board
size 199 x 149 mm; SheetNumber: 9; SheetTotal: 14
Used 2 times, as channels SPK1, SPK2. Parts and nets are listed once, with the designators drawn on the sheet.
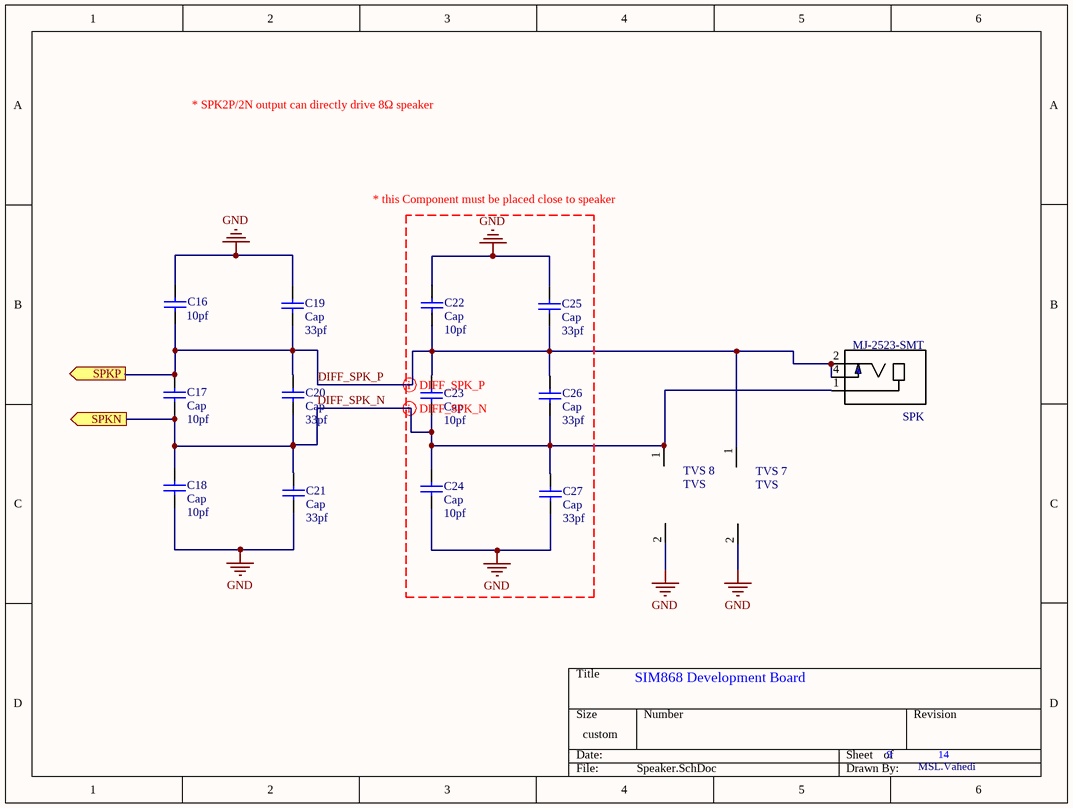
[diagram p10: Speaker.SchDoc]

### Parts
C16  value 10pf  [CAP0805]
C17  Cap  value 10pf  [CAP0805]
C18  Cap  value 10pf  [CAP0805]
C19  Cap  value 33pf  [CAP0805]
C20  Cap  value 33pf  [CAP0805]
C21  Cap  value 33pf  [CAP0805]
C22  Cap  value 10pf  [CAP0805]
C23  Cap  value 10pf  [CAP0805]
C24  Cap  value 10pf  [CAP0805]
C25  Cap  value 33pf  [CAP0805]
C26  Cap  value 33pf  [CAP0805]
C27  Cap  value 33pf  [CAP0805]
SPK  MJ-2523-SMT  [*CUI_MJ-2523-SMT]
TVS_7  TVS  [*FB_BLM18PG121SN1D]
TVS_8  TVS  [*FB_BLM18PG121SN1D]

### Ports
SPKN (out), SPKP (out)

### Nets
GND: C16.2 C18.1 C19.2 C21.1 C22.2 C24.1 C25.2 C27.1 TVS_7.2 TVS_8.2
DIFF_SPK_N: C17.1 C18.2 C20.1 C21.2 C23.1 C24.2 C26.1 C27.2 SPK.1(SLEEVE) TVS_8.1 ; port SPKN
DIFF_SPK_P: C16.1 C17.2 C19.1 C20.2 C22.1 C23.2 C25.1 C26.2 SPK.2(TIP) SPK.4(TIP_SWITCH) TVS_7.1 ; port SPKP

### Channels
SPK1: designators C16=C16_SPK1 C17=C17_SPK1 C18=C18_SPK1 C19=C19_SPK1 C20=C20_SPK1 C21=C21_SPK1 C22=C22_SPK1 C23=C23_SPK1 C24=C24_SPK1 C25=C25_SPK1 C26=C26_SPK1 C27=C27_SPK1 SPK=SPK_SPK1 TVS 7=TVS_7_SPK1 TVS 8=TVS_8_SPK1; ports SPKN=DIFF_SPK_N SPKP=DIFF_SPK_P
SPK2: designators C16=C16_SPK2 C17=C17_SPK2 C18=C18_SPK2 C19=C19_SPK2 C20=C20_SPK2 C21=C21_SPK2 C22=C22_SPK2 C23=C23_SPK2 C24=C24_SPK2 C25=C25_SPK2 C26=C26_SPK2 C27=C27_SPK2 SPK=SPK_SPK2 TVS 7=TVS_7_SPK2 TVS 8=TVS_8_SPK2; ports SPKN=DIFF_SPK_N SPKP=DIFF_SPK_P

### Layout directives
differential pair; differential pair class SPKDIFF: DIFF_SPK_N, DIFF_SPK_P

### Notes on the sheet
- * SPK2P/2N output can directly drive 8Ω speaker
- * this Component must be placed close to speaker
- MSL.Vahedi

### Library data of the parts
C16-C27 = Cap: Capacitor; Published: 8-Jun-2000; LatestRevisionDate: 17-Jul-2002; LatestRevisionNote: Re-released for DXP Platform.; PackageReference: RAD-0.3; Publisher: Altium Limited; PackageDescription: Radial Cap, Thru-Hole; 2 Leads; 0.3 in Pin Spacing
SPK = MJ-2523-SMT: Value: *

## Sheet connectors.SchDoc: SIM868 Development Board
size 149 x 149 mm; SheetNumber: 14; SheetTotal: 14
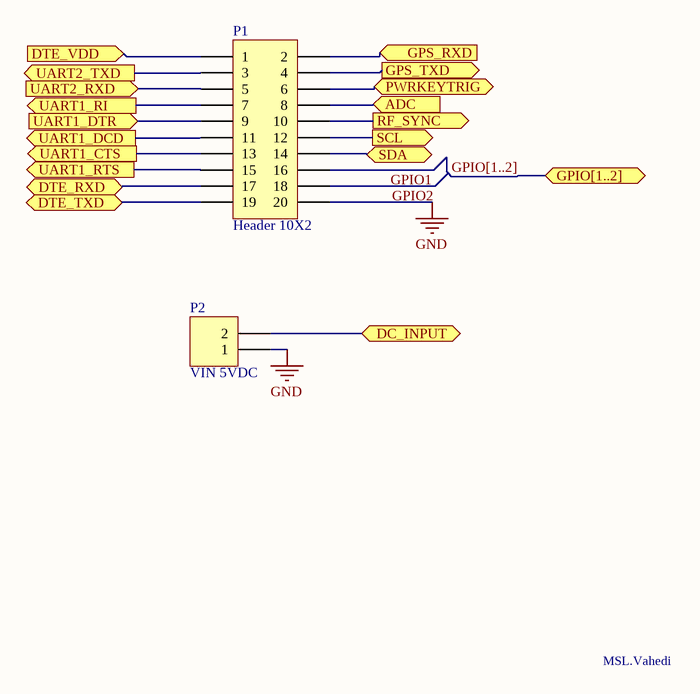
[diagram p11: connectors.SchDoc]

### Parts
P1  Header 10X2  [SULIN 20PIN]
P2  VIN 5VDC  [2PIN JACK]

### Ports
ADC (in), DC_INPUT (bidir), DTE_RXD (bidir), DTE_TXD (bidir), DTE_VDD (in), GPIO[1..2] (bidir), GPS_RXD (in), GPS_TXD (out), PWRKEYTRIG (bidir), RF_SYNC (out), SCL (out), SDA (bidir), UART1_CTS (out), UART1_DCD (out), UART1_DTR (in), UART1_RI (out), UART1_RTS (out), UART2_RXD (in), UART2_TXD (out)

### Nets
GND: P1.20 P2.1
DTE_RXD: P1.17 ; port DTE_RXD
DTE_TXD: P1.19 ; port DTE_TXD
DTE_VDD: P1.1 ; port DTE_VDD
GPIO1: P1.16
GPIO2: P1.18
INPUT: P2.2 ; port DC_INPUT
NetJ7_1: P1.6 ; port PWRKEYTRIG
NetM1_3: P1.15 ; port UART1_RTS
NetM1_4: P1.13 ; port UART1_CTS
NetM1_5: P1.11 ; port UART1_DCD
NetM1_6: P1.9 ; port UART1_DTR
NetM1_7: P1.7 ; port UART1_RI
NetM1_22: P1.3 ; port UART2_TXD
NetM1_23: P1.5 ; port UART2_RXD
NetM1_29: P1.10 ; port RF_SYNC
NetM1_38: P1.8 ; port ADC
NetM1_61: P1.4 ; port GPS_TXD
NetM1_62: P1.2 ; port GPS_RXD
NetM1_64: P1.14 ; port SDA
NetM1_65: P1.12 ; port SCL

### Buses and harness runs
bus GPIO[1..2] = port GPIO[1..2]

### Notes on the sheet
- MSL.Vahedi

### Library data of the parts
P1 = Header 10X2: Header, 10-Pin, Dual row; LatestRevisionDate: 17-Jul-2002; LatestRevisionNote: Re-released for DXP Platform.; Publisher: Altium Limited
P2 = Header 2: Header, 2-Pin; LatestRevisionDate: 17-Jul-2002; LatestRevisionNote: Re-released for DXP Platform.; Publisher: Altium Limited

## Sheet SIM CARD .SchDoc: SIM868 Development Board
size 199 x 149 mm; SheetNumber: 11; SheetTotal: 14
Used 2 times, as channels SIM_CARD1, SIM_CARD2. Parts and nets are listed once, with the designators drawn on the sheet.
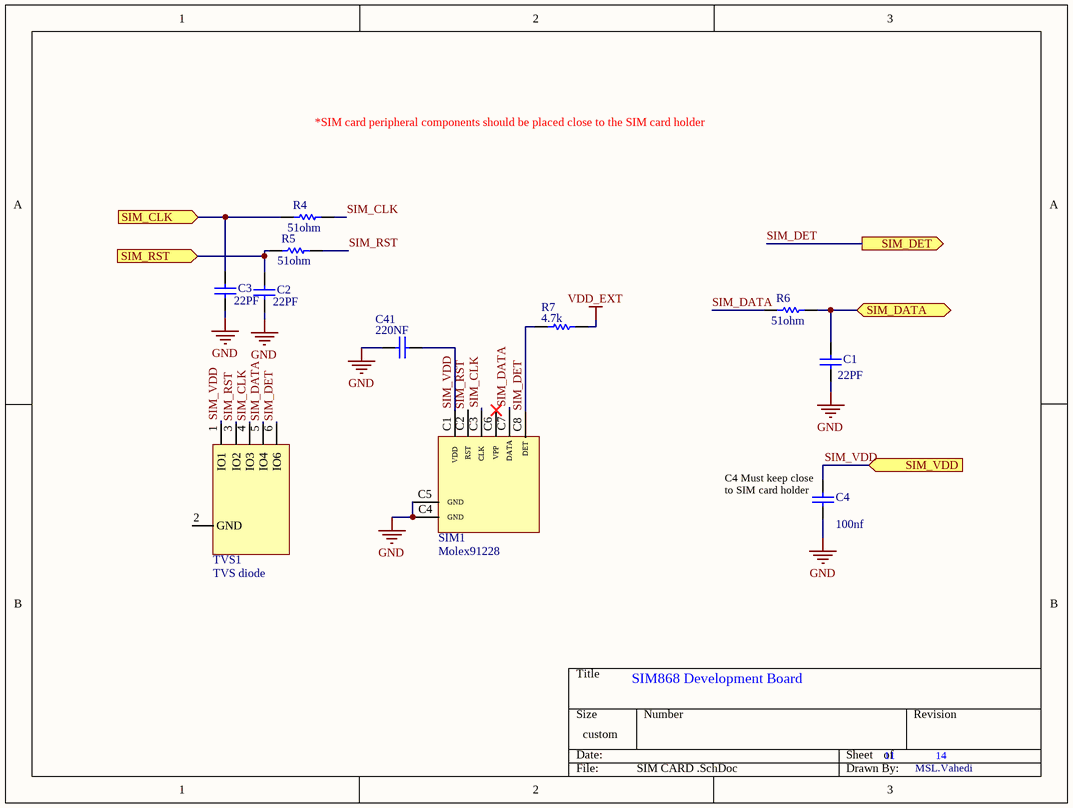
[diagram p12: SIM CARD .SchDoc]

### Parts
C1  value 22PF  [CAP0805]
C2  value 22PF  [CAP0805]
C3  value 22PF  [CAP0805]
C4  value 100nf  [CAP0805]
C41  value 220NF  [RES0805]
R4  value 51ohm  [RES0805]
R5  value 51ohm  [RES0805]
R6  value 51ohm  [RES0805]
R7  value 4.7k  [RES0805]
SIM1  Molex91228  [molex 91228]
TVS1  TVS diode  [*DIO_ESDA6V1-5W6]

### Ports
SIM_CLK (in), SIM_DATA (bidir), SIM_DET (out), SIM_RST (in), SIM_VDD (in)

### Nets
GND: C1.1 C2.1 C3.1 C4.2 C41.2 SIM1.C4(GND) SIM1.C5(GND)
VDD_EXT: R7.2
SIM_CLK: C3.2 R4.2 ; port SIM_CLK
SIM_CLK: R4.1 SIM1.C3(CLK) TVS1.4(IO3)  [a separate net that carries the same name]
SIM_DATA: R6.2 SIM1.C7(DATA) TVS1.5(IO4)
SIM_DATA: C1.2 R6.1 ; port SIM_DATA  [a separate net that carries the same name]
SIM_DET: R7.1 SIM1.C8(DET) TVS1.6(IO6) ; port SIM_DET
SIM_RST: C2.2 R5.2 ; port SIM_RST
SIM_RST: R5.1 SIM1.C2(RST) TVS1.3(IO2)  [a separate net that carries the same name]
SIM_VDD: C4.1 C41.1 SIM1.C1(VDD) TVS1.1(IO1) ; port SIM_VDD

Not connected (* = marked no-connect by the designer): SIM1 C6(VPP)*; TVS1 2(GND_)

### Channels
SIM_CARD1: designators end in _SIM_CARD1; ports SIM_CLK=SIM_CLK1 SIM_DATA=SIM_DATA1 SIM_DET=SIM_DET SIM_RST=SIM_RST1 SIM_VDD=SIM_VDD
SIM_CARD2: designators end in _SIM_CARD2; ports SIM_CLK=SIM_CLK2 SIM_DATA=SIM_DATA2 SIM_DET=SIM_DET SIM_RST=SIM_RST2 SIM_VDD=SIM_VDD

### Notes on the sheet
- *SIM card peripheral components should be placed close to the SIM card holder
- (near C4) C4 Must keep close to SIM card holder
- MSL.Vahedi

### Library data of the parts
C1-C4 C41 = Cap: Capacitor; Published: 8-Jun-2000; LatestRevisionDate: 17-Jul-2002; LatestRevisionNote: Re-released for DXP Platform.; PackageReference: RAD-0.3; Publisher: Altium Limited; PackageDescription: Radial Cap, Thru-Hole; 2 Leads; 0.3 in Pin Spacing
R4-R7 = Res1: Resistor; Published: 8-Jun-2000; LatestRevisionDate: 17-Jul-2002; LatestRevisionNote: Re-released for DXP Platform.; PackageReference: AXIAL-0.3; Publisher: Altium Limited; PackageDescription: Axial Device, Thru-Hole; 2 Leads; 0.3 in Pin Spacing
TVS1 = ESDA6V1

## Sheet Power_supply.SchDoc: SIM868 Development Board
size A4; SheetNumber: 12; SheetTotal: 14
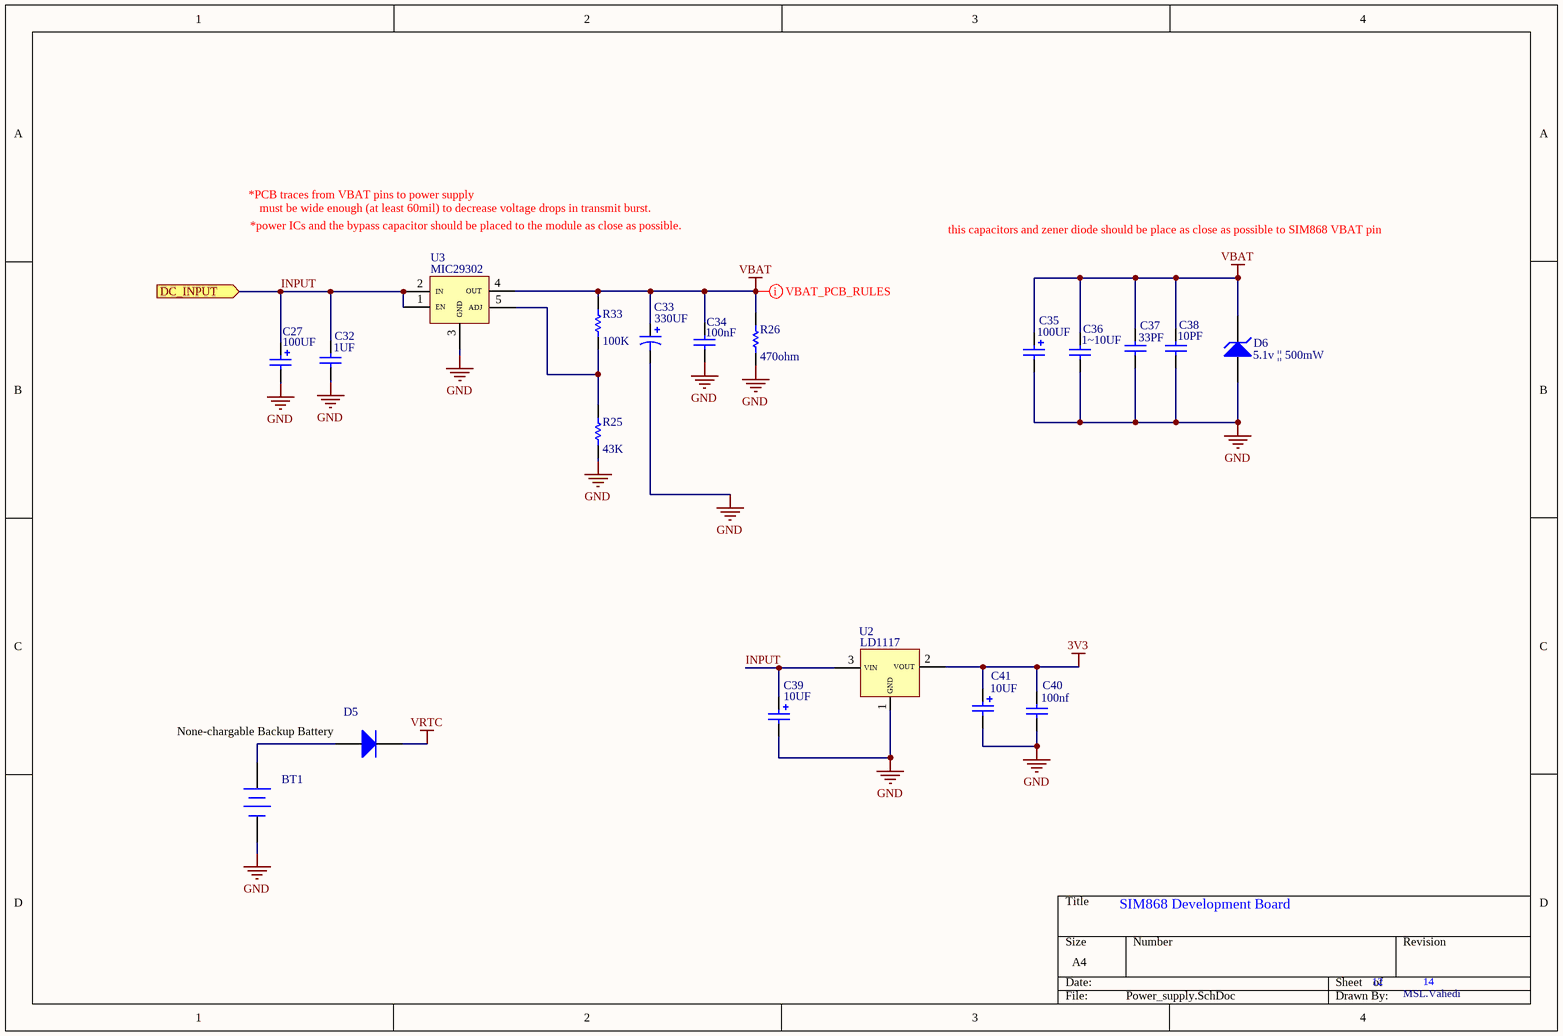
[diagram p13: Power_supply.SchDoc]

### Parts
BT1  None-chargable Backup Battery  [HDR1X2]
C27  value 100UF  [KEMET_A]
C32  value 1UF  [CAP0805]
C33  value 330UF  [KEMET_A]
C34  value 100nF  [CAP0805]
C35  value 100UF  [CAP0805]
C36  value 1~10UF  [CAP0805]
C37  value 33PF  [CAP0805]
C38  value 10PF  [CAP0805]
C39  value 10UF  [KEMET_A]
C40  value 100nf  [CAP0805]
C41  value 10UF  [KEMET_A]
D5  (no value)  [SOD-123]
D6  5.1v || 500mW  [SOD-123]
R25  value 43K  [RES0805]
R26  value 470ohm  [RES0805]
R33  value 100K  [RES0805]
U2  LD1117  [*DPAK228P972X240-3N]
U3  MIC29302  [MIC29302]

### Ports
DC_INPUT (in)

### Nets
3V3: C40.2 C41.1 U2.2(VOUT)
GND: BT1.2(-) C27.2 C32.1 C33.2 C34.1 C35.2 C36.2 C37.2 C38.2 C39.2 C40.1 C41.2 D6.1(A) R25.1 R26.1 U2.1(GND) U3.3(GND)
VBAT: C33.1 C34.2 C35.1 C36.1 C37.1 C38.1 D6.2(K) R26.2 R33.2 U3.4(OUT)
VRTC: D5.2(K)
INPUT: C27.1 C32.2 C39.1 U2.3(VIN) U3.1(EN) U3.2(IN) ; port DC_INPUT
NetBT1_1: BT1.1(+) D5.1(A)
NetR25_2: R25.2 R33.1 U3.5(ADJ)

### Layout directives
rule Width Constraint [Pref Width = 1.524mm    Min Width = 1.524mm    Max Width = 2mm]: VBAT

### Notes on the sheet
- *PCB traces from VBAT pins to power supply
- *power ICs and the bypass capacitor should be placed to the module as close as possible.
- must be wide enough (at least 60mil) to decrease voltage drops in transmit burst.
- this capacitors and zener diode should be place as close as possible to SIM868 VBAT pin
- MSL.Vahedi

### Library data of the parts
BT1 = Battery: Multicell Battery; Published: 24-Mar-1999; LatestRevisionDate: 17-Jul-2002; LatestRevisionNote: Re-released for DXP Platform.; PackageReference: BAT-2; Publisher: Altium Limited; PackageDescription: Battery; 2 Leads
C27 C35 C39 C41 = Cap Pol2: Polarized Capacitor (Axial); Published: 8-Jun-2000; LatestRevisionDate: 17-Jul-2002; LatestRevisionNote: Re-released for DXP Platform.; PackageReference: POLAR0.8; Publisher: Altium Limited; PackageDescription: Polarized Capacitor; 2 Leads
C32 C34 C36-C38 C40 = Cap: Capacitor; Published: 8-Jun-2000; LatestRevisionDate: 17-Jul-2002; LatestRevisionNote: Re-released for DXP Platform.; PackageReference: RAD-0.3; Publisher: Altium Limited; PackageDescription: Radial Cap, Thru-Hole; 2 Leads; 0.3 in Pin Spacing
C33 = Cap Pol1: Polarized Capacitor (Radial); Published: 8-Jun-2000; LatestRevisionDate: 17-Jul-2002; LatestRevisionNote: Re-released for DXP Platform.; PackageReference: RB7.6-15; Publisher: Altium Limited; PackageDescription: Polarized Capacitor (Radial); 2 Leads
D5 = Diode 1N4007: 1 Amp General Purpose Rectifier; Published: 8-Jun-2000; LatestRevisionDate: 17-Jul-2002; LatestRevisionNote: Re-released for DXP Platform.; DatasheetVersion: 1998; PackageVersion: Aug-1999; PackageReference: DO-41; Publisher: Altium Limited; PackageDescription: Diode, Axial; Body 5.2 x 2.7 mm (LxDia. max), Lead Dia. 0.86 mm (max); Code_JEDEC: DO-204-AL; ComponentLink1Description: Manufacturer Link; ComponentLink1URL: http://www.fairchildsemi.com/; ComponentLink2Description: Datasheet; ComponentLink2URL: http://www.fairchildsemi.com/ds/1N%2F1N4001.pdf
D6 = D Zener: MMSZ5231BT1G || PZ3DV2H || MMSZ4689-V || CDZ55V1SM; Published: 8-Jun-2000; LatestRevisionDate: 17-Jul-2002; LatestRevisionNote: Re-released for DXP Platform.; PackageReference: DIODE-0.7; Publisher: Altium Limited; PackageDescription: Diode, Thru-Hole; 2 Leads; 0.7 in Pin Spacing
R25 R26 R33 = Res1: Resistor; Published: 8-Jun-2000; LatestRevisionDate: 17-Jul-2002; LatestRevisionNote: Re-released for DXP Platform.; PackageReference: AXIAL-0.3; Publisher: Altium Limited; PackageDescription: Axial Device, Thru-Hole; 2 Leads; 0.3 in Pin Spacing
U3 = MIC29302: 3A Fast-Response LDO Regulator

## Nets that join several sheets
3V3: SD CARD  (5 pins), ANT (R14.1), Power_supply (C40.2 C41.1 U2.2)
GND: SIM868 (14 pins), SD CARD  (SD1.6), USB (C9.1 j9.5 TVS1.1), ANT (12 pins), U_ANT/AMC1 (C101_AMC1.1 C102_AMC1.1), U_ANT/AMC2 (C101_AMC2.1 C102_AMC2.1), U_ANT/AMC3 (C101_AMC3.1 C102_AMC3.1), STATUS_LEDS1 (Q1_STATUS_LEDS1.1 R16_STATUS_LEDS1.2), STATUS_LEDS2 (Q1_STATUS_LEDS2.1 R16_STATUS_LEDS2.2), STATUS_LEDS3 (Q1_STATUS_LEDS3.1 R16_STATUS_LEDS3.2), Power_Key (..1 Q2.1 R18.2 TVS_4.1), Microphone (6 pins), SPK1 (10 pins), SPK2 (10 pins), connectors (P1.20 P2.1), SIM_CARD1 (7 pins), SIM_CARD2 (7 pins), Power_supply (17 pins)
VBAT: SIM868 (M1.34 M1.35), STATUS_LEDS1 (D3_STATUS_LEDS1.1), STATUS_LEDS2 (D3_STATUS_LEDS2.1), STATUS_LEDS3 (D3_STATUS_LEDS3.1), Power_supply (10 pins)
VDD_EXT: SIM868 (M1.40 R1.2 R2.2 R3.2), Level_Matching (R19.1 R22.1), SIM_CARD1 (R7_SIM_CARD1.2), SIM_CARD2 (R7_SIM_CARD2.2)
VRTC: SIM868 (M1.28), Power_supply (D5.2)
ANT1: ANT (J1.1 J2.1 L1.2), U_ANT/AMC1 (C102_AMC1.2 R101_AMC1.2)
ANT2: ANT (J3.1 J4.1 TVS_3.1), U_ANT/AMC2 (C102_AMC2.2 R101_AMC2.2)
ANT3: ANT (J5.1 J6.1), U_ANT/AMC3 (C102_AMC3.2 R101_AMC3.2)
ANTP1: SIM868 (M1.32), U_ANT/AMC1 (C101_AMC1.2 R101_AMC1.1)
ANTP2: SIM868 (M1.68), U_ANT/AMC2 (C101_AMC2.2 R101_AMC2.1)
ANTP3: ANT (C112.2 C113.2 L111.2), U_ANT/AMC3 (C101_AMC3.2 R101_AMC3.1)
DATA0: SIM868 (M1.49), SD CARD  (R27.1 SD1.7)
DATA1: SIM868 (M1.48), SD CARD  (R28.1 SD1.8)
DATA2: SIM868 (M1.47), SD CARD  (R29.1 SD1.1)
DATA3: SIM868 (M1.46), SD CARD  (R30.1 SD1.2)
DIFF_SPK_N: SIM868 (M1.12), SPK1 (10 pins)
DIFF_SPK_N: SIM868 (M1.43), SPK2 (10 pins)
DIFF_SPK_P: SIM868 (M1.11), SPK1 (11 pins)
DIFF_SPK_P: SIM868 (M1.44), SPK2 (11 pins)
DTE_RXD: Level_Matching (Q3.3 R20.2), connectors (P1.17)
DTE_TXD: Level_Matching (Q4.1 R23.2), connectors (P1.19)
DTE_VDD: Level_Matching (R20.1 R23.1), connectors (P1.1)
GPIO1: SIM868 (M1.57), connectors (P1.16)
GPIO2: SIM868 (M1.58), connectors (P1.18)
INPUT: connectors (P2.2), Power_supply (6 pins)
LED1: SIM868 (M1.60), STATUS_LEDS1 (R15_STATUS_LEDS1.1)
LED2: SIM868 (M1.42), STATUS_LEDS2 (R15_STATUS_LEDS2.1)
LED3: SIM868 (M1.41), STATUS_LEDS3 (R15_STATUS_LEDS3.1)
MIC_N: SIM868 (M1.10), Microphone (5 pins)
MIC_P: SIM868 (M1.9), Microphone (C10.2 C11.1 FB1.2)
Net._2: SIM868 (M1.39), Power_Key (..2 Q2.3 TVS_4.2)
NetC9_2: SIM868 (M1.24), USB (C9.2 j9.1 TVS1.4)
NetC108_2: SIM868 (M1.20), ANT (C108.2 L110.1)
NetJ7_1: Power_Key (J7.1), connectors (P1.6)
NetM1_1: SIM868 (M1.1), Level_Matching (Q3.1 R21.2)
NetM1_2: SIM868 (M1.2), Level_Matching (Q4.3 R24.2)
NetM1_3: SIM868 (M1.3), connectors (P1.15)
NetM1_4: SIM868 (M1.4), connectors (P1.13)
NetM1_5: SIM868 (M1.5), connectors (P1.11)
NetM1_6: SIM868 (M1.6), connectors (P1.9)
NetM1_7: SIM868 (M1.7), connectors (P1.7)
NetM1_22: SIM868 (M1.22), connectors (P1.3)
NetM1_23: SIM868 (M1.23), connectors (P1.5)
NetM1_25: SIM868 (M1.25), USB (R12.1)
NetM1_26: SIM868 (M1.26), USB (R13.1)
NetM1_29: SIM868 (M1.29), connectors (P1.10)
NetM1_38: SIM868 (M1.38), connectors (P1.8)
NetM1_50: SIM868 (M1.50), SD CARD  (SD1.5)
NetM1_51: SIM868 (M1.51), SD CARD  (SD1.3)
NetM1_61: SIM868 (M1.61), connectors (P1.4)
NetM1_62: SIM868 (M1.62), connectors (P1.2)
NetM1_64: SIM868 (M1.64 R3.1), connectors (P1.14)
NetM1_65: SIM868 (M1.65 R2.1), connectors (P1.12)
SIM_CLK1: SIM868 (M1.54), SIM_CARD1 (C3_SIM_CARD1.2 R4_SIM_CARD1.2)
SIM_CLK2: SIM868 (M1.16), SIM_CARD2 (C3_SIM_CARD2.2 R4_SIM_CARD2.2)
SIM_DATA1: SIM868 (M1.53), SIM_CARD1 (C1_SIM_CARD1.2 R6_SIM_CARD1.1)
SIM_DATA2: SIM868 (M1.15), SIM_CARD2 (C1_SIM_CARD2.2 R6_SIM_CARD2.1)
SIM_DET: SIM868 (M1.14), SIM_CARD2 (R7_SIM_CARD2.1 SIM1_SIM_CARD2.C8 TVS1_SIM_CARD2.6)
SIM_DET: SIM868 (M1.52), SIM_CARD1 (R7_SIM_CARD1.1 SIM1_SIM_CARD1.C8 TVS1_SIM_CARD1.6)
SIM_RST1: SIM868 (M1.55), SIM_CARD1 (C2_SIM_CARD1.2 R5_SIM_CARD1.2)
SIM_RST2: SIM868 (M1.17), SIM_CARD2 (C2_SIM_CARD2.2 R5_SIM_CARD2.2)
SIM_VDD: SIM868 (M1.18), SIM_CARD2 (C4_SIM_CARD2.1 C41_SIM_CARD2.1 SIM1_SIM_CARD2.C1 TVS1_SIM_CARD2.1)
SIM_VDD: SIM868 (M1.56), SIM_CARD1 (C4_SIM_CARD1.1 C41_SIM_CARD1.1 SIM1_SIM_CARD1.C1 TVS1_SIM_CARD1.1)